# Altium schematic sheet 0.Main.SchDoc
size A4; DocumentNumber: 01; SheetNumber: 1; SheetTotal: 8; Page: Block Diagram
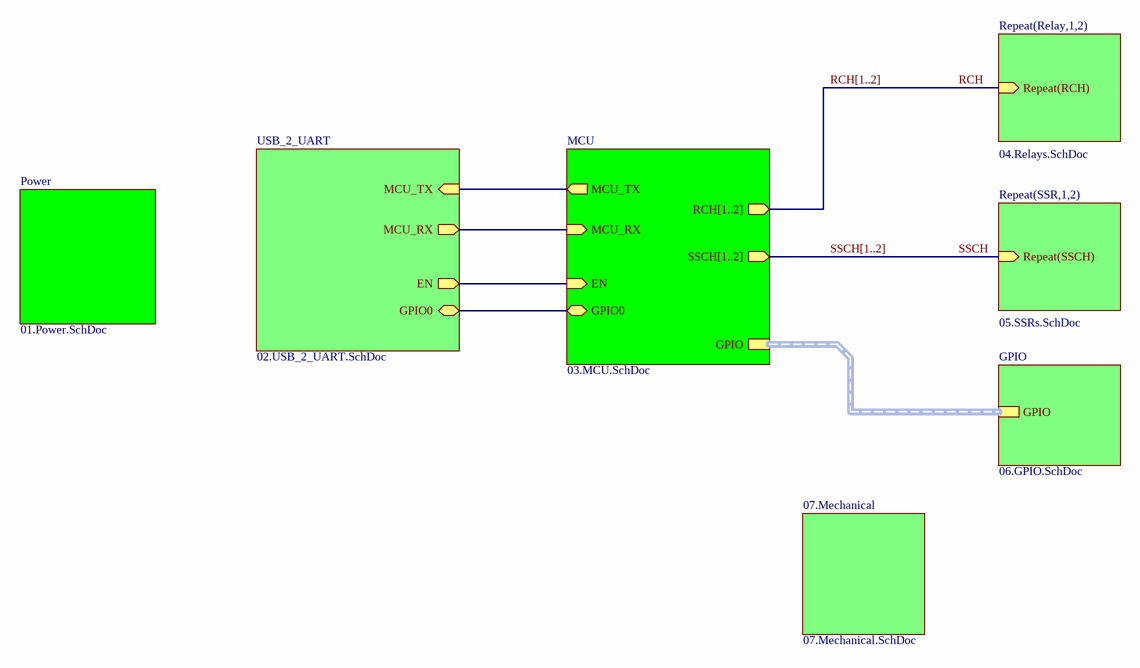
[diagram p0: 0.Main.SchDoc]

## Sub-sheets
07.Mechanical = 07.Mechanical.SchDoc: no entries
GPIO = 06.GPIO.SchDoc: GPIO (harness GPIO)
MCU = 03.MCU.SchDoc: EN (in), GPIO0 (bidir), GPIO (harness GPIO), MCU_TX (out), MCU_RX (in), RCH[1..2] (out), SSCH[1..2] (out)
Power = 01.Power.SchDoc: no entries
Repeat(Relay,1,2) = 04.Relays.SchDoc: Repeat(RCH) (in)
Repeat(SSR,1,2) = 05.SSRs.SchDoc: Repeat(SSCH) (in)
USB_2_UART = 02.USB_2_UART.SchDoc: MCU_RX (out), MCU_TX (in), EN (out), GPIO0 (bidir)

## Nets
RCH: sheet Repeat(Relay,1,2)/Repeat(RCH)
SSCH: sheet Repeat(SSR,1,2)/Repeat(SSCH)
(unnamed): sheet USB_2_UART/MCU_RX, sheet MCU/MCU_RX
(unnamed): sheet USB_2_UART/MCU_TX, sheet MCU/MCU_TX
(unnamed): sheet USB_2_UART/EN, sheet MCU/EN
(unnamed): sheet USB_2_UART/GPIO0, sheet MCU/GPIO0

## Buses and harness runs
bus RCH[1..2] = sheet MCU/RCH[1..2]
bus SSCH[1..2] = sheet MCU/SSCH[1..2]
harness sheet GPIO/GPIO = sheet MCU/GPIO

## Notes on the sheet
- Title :
- Size:
- Date:
- Page :
- A4
- Number:
- Time:
- Revision:
- Sheet
- of
- Sheet Name :
- Drawn By :